# EAGLE schematic PRA_2_5_23@1 (EAGLE 6.3)
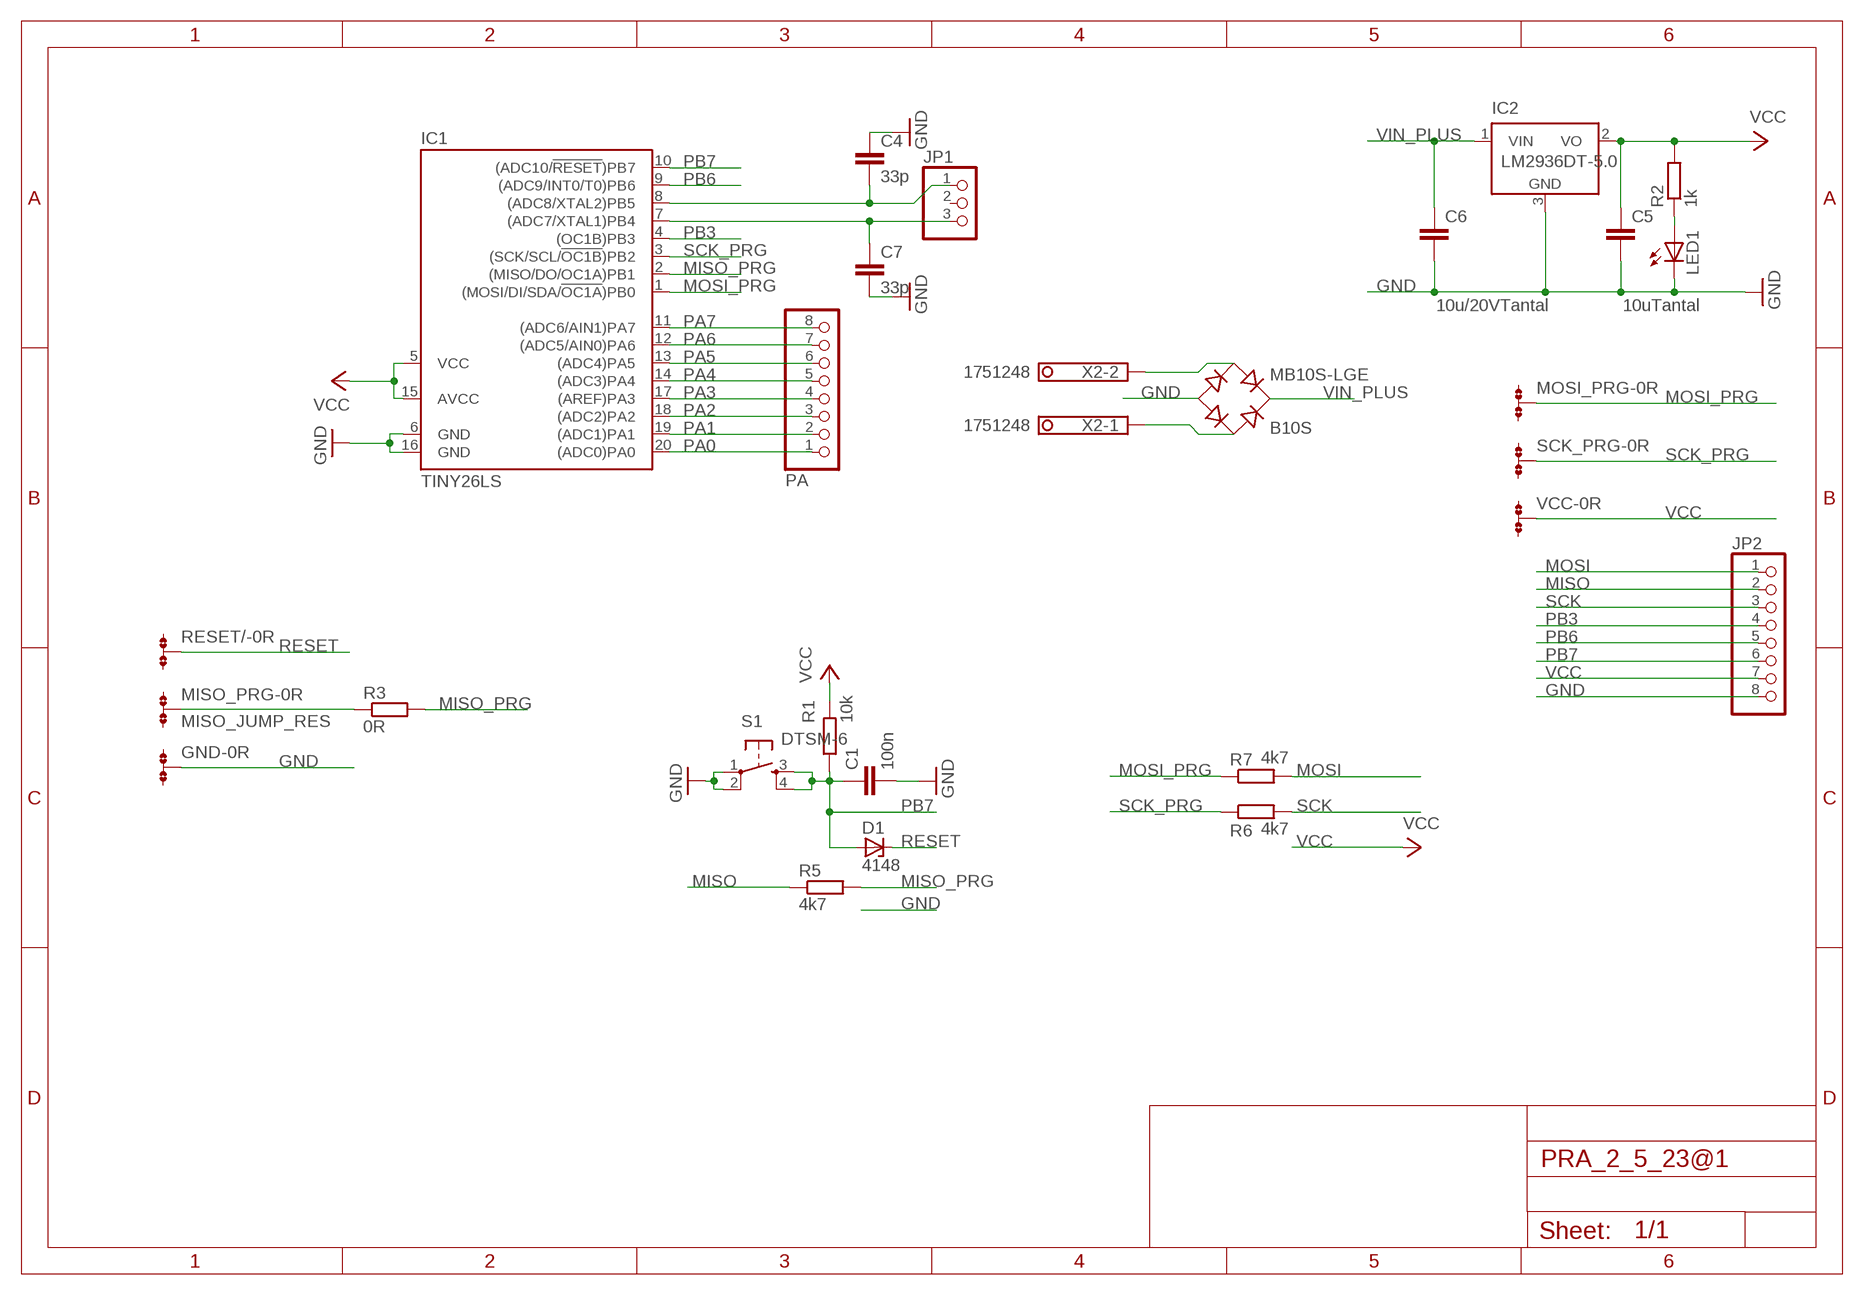
[diagram p0: schematic, sheet 1]

## Parts
C1  100n  C-EUC1206  [C1206]
C4  33p  C-EUC1206  [C1206]
C5  10uTantal  C-EUC1206K  [C1206K]
C6  10u/20VTantal  C-EUC1206K  [C1206K]
C7  33p  C-EUC1206  [C1206]
D1  4148  ZENER-DIODESMB  [SMB]
GND  0R-JUMPA  [A0R-JMP]
IC1  TINY26LS  [SO20L]
IC2  LM2936DT-5.0  [TO252]
JP1  PINHD-1X3  [1X03]
JP2  PINHD-1X8/90  [1X08/90]
LED1  LEDSMT1206  [1206]
MB10S-LGE  B10S  [MBS]
MISO_PRG  0R-JUMPA  [A0R-JMP]
MOSI_PRG  0R-JUMPA  [A0R-JMP]
PA  PINHD-1X8/90  [1X08/90]
R1  10k  R-EU_R1206  [R1206]
R2  1k  R-EU_R1206  [R1206]
R3  0R  R-EU_M1406  [M1406]
R5  4k7  R-EU_R1206  [R1206]
R6  4k7  R-EU_R1206  [R1206]
R7  4k7  R-EU_R1206  [R1206]
RESET/  0R-JUMPA  [A0R-JMP]
S1  DTSM-6  [DTSM-6]
SCK_PRG  0R-JUMPA  [A0R-JMP]
VCC  0R-JUMPA  [A0R-JMP]
X2  1751248  [1751248]

## Nets
GND: C1.2 C4.1 C5.2 C6.2 C7.2 GND.2 IC1.6(GND) IC1.16(GND) IC2.3(GND) JP2.8 LED1.C MB10S-LGE.- S1.1 S1.2
MISO: JP2.2 R5.1
MISO_JUMP_RES: MISO_PRG.2 R3.1
MISO_PRG: IC1.2((MISO/DO/OC1A)PB1) R3.2 R5.2
MOSI: JP2.1 R7.2
MOSI_PRG: IC1.1((MOSI/DI/SDA/!OC1A!)PB0) MOSI_PRG.2 R7.1
N$15: C4.2 IC1.8((ADC8/XTAL2)PB5) JP1.1
N$16: C7.1 IC1.7((ADC7/XTAL1)PB4) JP1.3
N$17: MB10S-LGE.AC2 X2.1
N$29: MB10S-LGE.AC1 X2.2
N$30: LED1.A R2.1
PA0: IC1.20((ADC0)PA0) PA.1
PA1: IC1.19((ADC1)PA1) PA.2
PA2: IC1.18((ADC2)PA2) PA.3
PA3: IC1.17((AREF)PA3) PA.4
PA4: IC1.14((ADC3)PA4) PA.5
PA5: IC1.13((ADC4)PA5) PA.6
PA6: IC1.12((ADC5/AIN0)PA6) PA.7
PA7: IC1.11((ADC6/AIN1)PA7) PA.8
PB3: IC1.4((OC1B)PB3) JP2.4
PB6: IC1.9((ADC9/INT0/T0)PB6) JP2.5
PB7: C1.1 D1.A IC1.10((ADC10/!RESET!)PB7) JP2.6 R1.1 S1.3 S1.4
RESET: D1.C RESET/.2
SCK: JP2.3 R6.2
SCK_PRG: IC1.3((SCK/SCL/!OC1B!)PB2) R6.1 SCK_PRG.2
VCC: C5.1 IC1.5(VCC) IC1.15(AVCC) IC2.2(VO) JP2.7 R1.2 R2.2 VCC.2
VIN_PLUS: C6.1 IC2.1(VIN) MB10S-LGE.+
Unconnected: GND.1 GND.3 JP1.2 MISO_PRG.1 MISO_PRG.3 MOSI_PRG.1 MOSI_PRG.3 RESET/.1 RESET/.3 SCK_PRG.1 SCK_PRG.3 VCC.1 VCC.3

## Library data of the parts
C1 C4-C7 = rcl:C-EU: CAPACITOR, European symbol
D1 = diode:ZENER-DIODE: Z-Diode
GND MISO_PRG MOSI_PRG RESET/ SCK_PRG VCC = jump-0r-smd:0R-JUMP: SMD 0R 0805 Jumper
IC1 = atmel:TINY26*: 8-bit AVR Microcontroller with 2K Bytes Flash Source: http://www.atmel.com .. doc1477.pdf; MPN: ATTINY26L-8SU; OC_FARNELL: 9171665; OC_NEWARK: 01M6921
IC2 = national-semiconductor:LM2936?*: Ultra-Low Quiescent Current LDO Voltage Regulator Source: Data sheet <http://www.national.com/ds/LM/LM2936.pdf>; MF: NATIONAL SEMICONDUCTOR; MPN: LM2936DT-5.0/NOPB; OC_FARNELL: 1286864; OC_NEWARK: 41K4501
JP1 = pinhead:PINHD-1X3: PIN HEADER
JP2 PA = pinhead:PINHD-1X8: PIN HEADER
LED1 = led:LED: LED OSRAM: - CHIPLED LG R971, LG N971, LY N971, LG Q971, LY Q971, LO R971, LY R971 LH N974, LH R974 LS Q976, LO Q976, LY Q976 LO Q996 - Hyper CHIPLED LW Q18S LB Q993, LB Q99A, LB R99A - SideLED LS A670, LO A670, LY A670, LG A670, LP A670 LB A673, LV A673, LT A673, LW A673 LH A674 LY A675 LS A676, LA A676, LO A676, LY A676, LW A676 LS A679, LY A679, LG A679 - Hyper Micro SIDELED® LS Y876, LA Y876, LO Y876, LY Y876 LT Y87S - SmartLED LW L88C, LW L88S LB L89C, LB L89S, LG L890 LS L89K, LO L89K, LY L89K LS L896, LA L896, LO L896, LY L896 - TOPLED LS T670, LO T670, LY T670, LG T670, LP T670 LSG T670, LSP T670, LSY T670, LOP T670, LYG T670 LG T671, LOG T671, LSG T671 LB T673, LV T673, LT T673, LW T673 LH T674 LS T676, LA T676, LO T676, LY T676, LB T676, LH T676, LSB T676, LW T676 LB T67C, LV T67C, LT T67C, LS T67K, LO T67K, LY T67K, LW E67C LS E67B, LA E67B, LO E67B, LY E67B, LB E67C, LV E67C, LT E67C LW T67C LS T679, LY T679, LG T679 LS T770, LO T770, LY T770, LG T770, LP T770 LB T773, LV T773, LT T773, LW T773 LH T774 LS E675, LA E675, LY E675, LS T675 LS T776, LA T776, LO T776, LY T776, LB T776 LHGB T686 LT T68C, LB T68C - Hyper Mini TOPLED® LB M676 - Mini TOPLED Santana® LG M470 LS M47K, LO M47K, LY M47K Source: http://www.osram.convergy.de LUXEON: - LUMILED® LXK2-PW12-R00, LXK2-PW12-S00, LXK2-PW14-U00, LXK2-PW14-V00 LXK2-PM12-R00, LXK2-PM12-S00, LXK2-PM14-U00 LXK2-PE12-Q00, LXK2-PE12-R00, LXK2-PE12-S00, LXK2-PE14-T00, LXK2-PE14-U00 LXK2-PB12-K00, LXK2-PB12-L00, LXK2-PB12-M00, LXK2-PB14-N00, LXK2-PB14-P00, LXK2-PB14-Q00 LXK2-PR12-L00, LXK2-PR12-M00, LXK2-PR14-Q00, LXK2-PR14-R00 LXK2-PD12-Q00, LXK2-PD12-R00, LXK2-PD12-S00 LXK2-PH12-R00, LXK2-PH12-S00 LXK2-PL12-P00, LXK2-PL12-Q00, LXK2-PL12-R00 Source: www.luxeon.com KINGBRIGHT: KA-3528ASYC Source: www.kingbright.com
MB10S-LGE = rectifier:B*S: Surface Mount Glass Passivated Bridge Rectifiers Source: Comchip Bridge Rectifiers B05S-G_B10S-G.pdf
R1-R3 R5-R7 = rcl:R-EU_: RESISTOR, European symbol
S1 = switch-tact:DTSM-6
X2 = con-phoenix-350:1751248: MKDS 1/ 2-3,5 Printklemme Nennstrom: 10 A Bemessungsspannung: 160 V Raster: 3,5 mm Polzahl: 2 Montageart: Löten Anschlussart: Schraubanschluss Anschlussrichtung vom Leiter zur Platine: 0° Source: http://eshop.phoenixcontact.com .. 1751248.pdf; OC_FARNELL: unknown; OC_NEWARK: unknown